# Altium schematic sheet Overall.SchDoc
size A
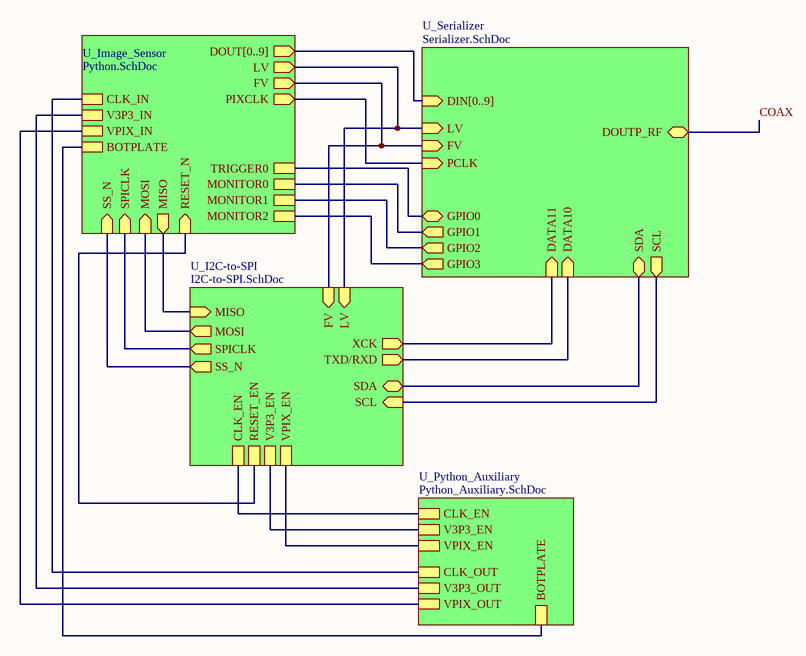
[diagram p0: Overall.SchDoc]

## Sub-sheets
U_I2C-to-SPI = I2C-to-SPI.SchDoc: SCL (in), SDA (bidir), MOSI (out), MISO (in), SPICLK (out), SS_N (out), TXD/RXD (out), XCK (out), FV (in), LV (in), CLK_EN, RESET_EN, V3P3_EN, VPIX_EN
U_Image_Sensor = Python.SchDoc: FV (out), LV (out), PIXCLK (out), DOUT[0..9] (out), SS_N (in), MISO (out), MOSI (in), SPICLK (in), RESET_N (in), CLK_IN, V3P3_IN, VPIX_IN, BOTPLATE, TRIGGER0, MONITOR0, MONITOR1, MONITOR2
U_Python_Auxiliary = Python_Auxiliary.SchDoc: CLK_EN, V3P3_EN, VPIX_EN, CLK_OUT, V3P3_OUT, VPIX_OUT, BOTPLATE
U_Serializer = Serializer.SchDoc: GPIO3 (out), GPIO2 (out), GPIO1 (out), GPIO0 (bidir), LV (in), FV (in), PCLK (in), SCL (out), SDA (bidir), DIN[0..9] (in), DOUTP_RF (bidir), DATA10 (in), DATA11 (in)

## Nets
COAX: sheet U_Serializer/DOUTP_RF
(unnamed): sheet U_Image_Sensor/FV, sheet U_Serializer/FV, sheet U_I2C-to-SPI/FV
(unnamed): sheet U_Image_Sensor/LV, sheet U_Serializer/LV, sheet U_I2C-to-SPI/LV
(unnamed): sheet U_Image_Sensor/PIXCLK, sheet U_Serializer/PCLK
(unnamed): sheet U_Image_Sensor/SS_N, sheet U_I2C-to-SPI/SS_N
(unnamed): sheet U_Image_Sensor/MISO, sheet U_I2C-to-SPI/MISO
(unnamed): sheet U_Image_Sensor/MOSI, sheet U_I2C-to-SPI/MOSI
(unnamed): sheet U_Image_Sensor/SPICLK, sheet U_I2C-to-SPI/SPICLK
(unnamed): sheet U_Image_Sensor/RESET_N, sheet U_I2C-to-SPI/RESET_EN
(unnamed): sheet U_Image_Sensor/CLK_IN, sheet U_Python_Auxiliary/CLK_OUT
(unnamed): sheet U_Image_Sensor/V3P3_IN, sheet U_Python_Auxiliary/V3P3_OUT
(unnamed): sheet U_Image_Sensor/VPIX_IN, sheet U_Python_Auxiliary/VPIX_OUT
(unnamed): sheet U_Image_Sensor/BOTPLATE, sheet U_Python_Auxiliary/BOTPLATE
(unnamed): sheet U_Image_Sensor/TRIGGER0, sheet U_Serializer/GPIO0
(unnamed): sheet U_Image_Sensor/MONITOR0, sheet U_Serializer/GPIO1
(unnamed): sheet U_Image_Sensor/MONITOR1, sheet U_Serializer/GPIO2
(unnamed): sheet U_Image_Sensor/MONITOR2, sheet U_Serializer/GPIO3
(unnamed): sheet U_Serializer/SCL, sheet U_I2C-to-SPI/SCL
(unnamed): sheet U_Serializer/SDA, sheet U_I2C-to-SPI/SDA
(unnamed): sheet U_Serializer/DATA10, sheet U_I2C-to-SPI/TXD/RXD
(unnamed): sheet U_Serializer/DATA11, sheet U_I2C-to-SPI/XCK
(unnamed): sheet U_I2C-to-SPI/CLK_EN, sheet U_Python_Auxiliary/CLK_EN
(unnamed): sheet U_I2C-to-SPI/V3P3_EN, sheet U_Python_Auxiliary/V3P3_EN
(unnamed): sheet U_I2C-to-SPI/VPIX_EN, sheet U_Python_Auxiliary/VPIX_EN

## Buses and harness runs
bus sheet U_Image_Sensor/DOUT[0..9] = sheet U_Serializer/DIN[0..9]